# EAGLE design stm_board_f407_1.2.4 (EAGLE 9.6.2)
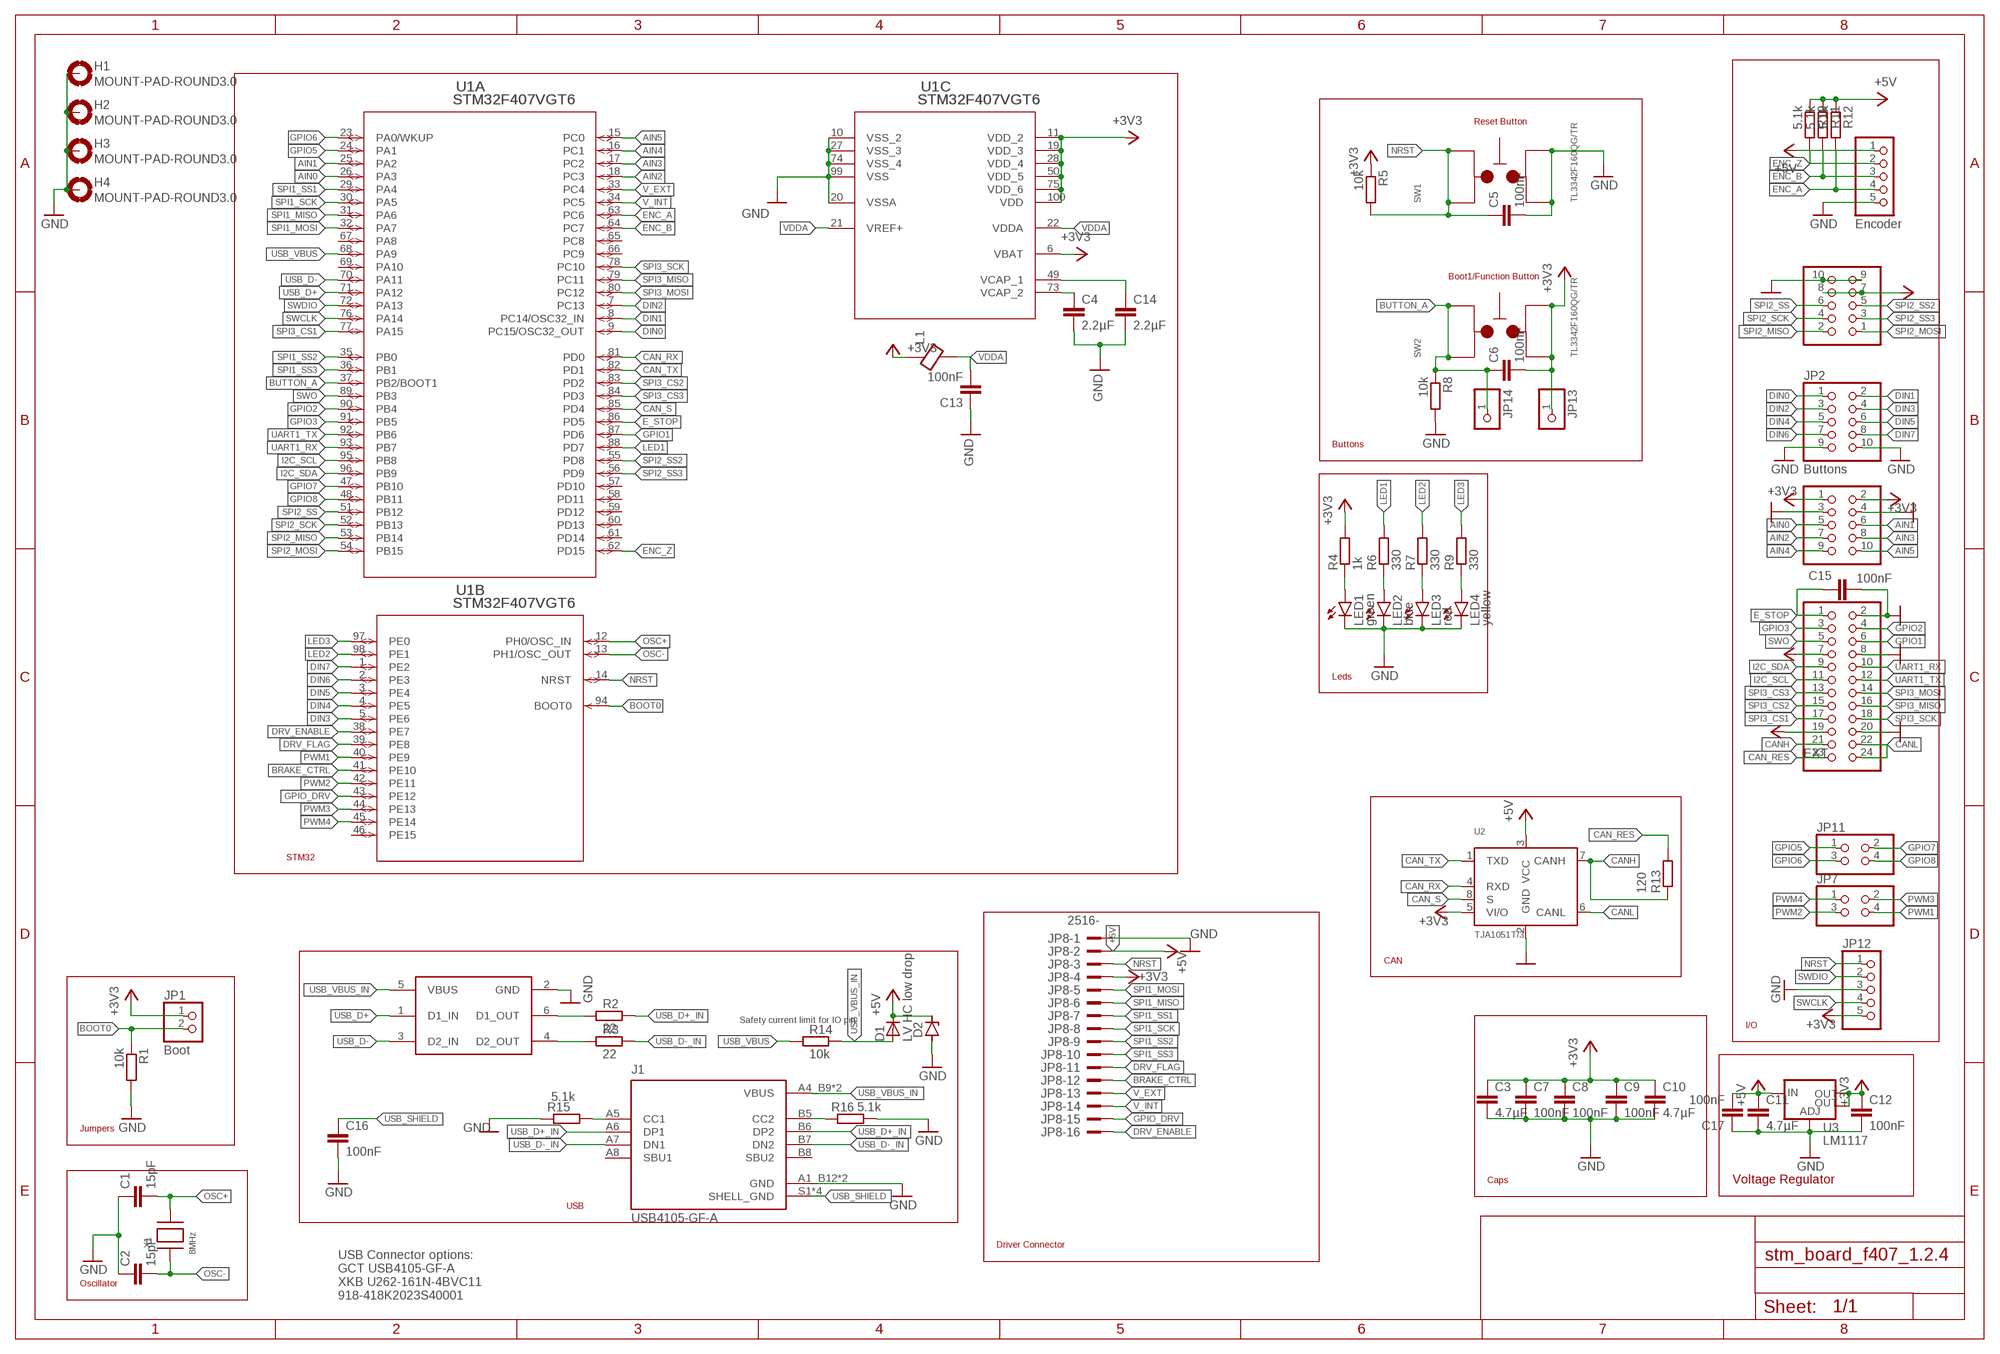
[diagram p0: schematic, sheet 1]

## Parts
C1  15pF  C-EUC0603  [C0603]
C2  15pF  C-EUC0603  [C0603]
C3  4.7µF  C-EUC0805  [C0805]
C4  2.2µF  C-EUC0603  [C0603]
C5  100nF  C-EUC0603  [C0603]
C6  100nF  C-EUC0603  [C0603]
C7  100nF  C-EUC0603  [C0603]
C8  100nF  C-EUC0603  [C0603]
C9  100nF  C-EUC0603  [C0603]
C10  4.7µF  C-EUC0805  [C0805]
C11  4.7µF  C-EUC0805  [C0805]
C12  100nF  C-EUC0603  [C0603]
C13  100nF  C-EUC0603  [C0603]
C14  2.2µF  C-EUC0603  [C0603]
C15  100nF  C-EUC0603  [C0603]
C16  100nF  C-EUC0603  [C0603]
C17  100nF  C-EUC0603  [C0603]
D1  LV HC low drop  DIODESMA  [SMADIODE]
D2  ZENER-DIODESOD80C  [SOD80C]
H1  MOUNT-PAD-ROUND3.0  [3,0-PAD]
H2  MOUNT-PAD-ROUND3.0  [3,0-PAD]
H3  MOUNT-PAD-ROUND3.0  [3,0-PAD]
H4  MOUNT-PAD-ROUND3.0  [3,0-PAD]
J1  USB4105-GF-A  [GCT_USB4105-GF-A]
JP1  Boot  PINHD-1X2  [1X02]
JP2  Buttons  PINHD-2X5  [2X05]
JP3  Analog  PINHD-2X5  [2X05]
JP4  EXT  PINHD-2X12  [2X12]
JP5  Encoder  PINHD-1X5  [1X05]
JP6  SPI  PINHD-2X5  [2X05]
JP7  PINHD-2X2  [2X02]
JP8  2516-  [PAK100/2500-16]
JP11  PINHD-2X2  [2X02]
JP12  PINHD-1X5  [1X05]
JP13  PINHD-1X1  [1X01]
JP14  PINHD-1X1  [1X01]
L1  GZ2012D601TF  BLM21PG331SN1D  [BLM21PG331SN1D]
LED1  green  LEDSML0805  [SML0805]
LED2  blue  LEDSML0805  [SML0805]
LED3  red  LEDSML0805  [SML0805]
LED4  yellow  LEDSML0805  [SML0805]
R1  10k  R-EU_R0603  [R0603]
R2  22  R-EU_R0603  [R0603]
R3  22  R-EU_R0603  [R0603]
R4  1k  R-EU_R0603  [R0603]
R5  10k  R-EU_R0603  [R0603]
R6  330  R-EU_R0603  [R0603]
R7  330  R-EU_R0603  [R0603]
R8  10k  R-EU_R0603  [R0603]
R9  330  R-EU_R0603  [R0603]
R10  5.1k  R-EU_R0603  [R0603]
R11  5.1k  R-EU_R0603  [R0603]
R12  5.1k  R-EU_R0603  [R0603]
R13  120  R-EU_R0603  [R0603]
R14  10k  R-EU_R0603  [R0603]
R15  5.1k  R-EU_R0603  [R0603]
R16  5.1k  R-EU_R0603  [R0603]
SW1  TL3342F160QG/TR  [TL3342F160QG/TR]
SW2  TL3342F160QG/TR  [TL3342F160QG/TR]
U1  STM32F407VGT6  [LQFP100-14X14MM]
U2  TJA1051T/3  [SOT96-1]
U3  LM1117  V_REG_LM1117SOT223  [SOT223]
U4  USBLC6-2SC6  [TSOT-23-6]
X1  8MHz  XTALNX5032  [NX5032]

## Nets
+3V3: C3.1 C6.2 C7.1 C8.1 C9.1 C10.1 C12.1 JP1.1 JP3.1 JP3.2 JP4.7 JP6.7 JP6.8 JP8.4 JP12.5 JP13.1 L1.1 R4.2 R5.1 SW2.1 SW2.2 U1.6(C:VBAT) U1.11(C:VDD_2) U1.19(C:VDD_3) U1.28(C:VDD_4) U1.50(C:VDD_5) U1.75(C:VDD_6) U1.100(C:VDD) U2.5(VI/O) U3.2(OUT) U3.4(OUT)
+5V: C11.1 C17.2 D1.C D2.C JP4.19 JP5.1 JP8.2 R10.1 R11.1 R12.1 U2.3(VCC) U3.3(IN)
AIN0: JP3.5 U1.26(A:PA3)
AIN1: JP3.6 U1.25(A:PA2)
AIN2: JP3.7 U1.18(A:PC3)
AIN3: JP3.8 U1.17(A:PC2)
AIN4: JP3.9 U1.16(A:PC1)
AIN5: JP3.10 U1.15(A:PC0)
BOOT0: JP1.2 R1.1 U1.94(B:BOOT0)
BRAKE_CTRL: JP8.12 U1.41(B:PE10)
BUTTON_A: C6.1 JP14.1 R8.1 SW2.3 SW2.4 U1.37(A:PB2/BOOT1)
CAN_RES: JP4.23 R13.2
CAN_RX: U1.81(A:PD0) U2.4(RXD)
CAN_S: U1.85(A:PD4) U2.8(S)
CAN_TX: U1.82(A:PD1) U2.1(TXD)
CANH: JP4.21 R13.1 U2.7(CANH)
CANL: JP4.22 JP4.24 U2.6(CANL)
DIN0: JP2.1 U1.9(A:PC15/OSC32_OUT)
DIN1: JP2.2 U1.8(A:PC14/OSC32_IN)
DIN2: JP2.3 U1.7(A:PC13)
DIN3: JP2.4 U1.5(B:PE6)
DIN4: JP2.5 U1.4(B:PE5)
DIN5: JP2.6 U1.3(B:PE4)
DIN6: JP2.7 U1.2(B:PE3)
DIN7: JP2.8 U1.1(B:PE2)
DRV_ENABLE: JP8.16 U1.38(B:PE7)
DRV_FLAG: JP8.11 U1.39(B:PE8)
E_STOP: C15.1 JP4.1 U1.86(A:PD5)
ENC_A: JP5.4 R12.2 U1.63(A:PC6)
ENC_B: JP5.3 R11.2 U1.64(A:PC7)
ENC_Z: JP5.2 R10.2 U1.62(A:PD15)
GND: C1.1 C2.1 C3.2 C4.2 C5.2 C7.2 C8.2 C9.2 C10.2 C11.2 C12.2 C13.1 C14.2 C15.2 C16.2 C17.1 D2.A H1.B3,0(MOUNT) H2.B3,0(MOUNT) H3.B3,0(MOUNT) H4.B3,0(MOUNT) J1.A1_B12(GND) J1.B1_A12(GND) JP2.9 JP2.10 JP3.3 JP3.4 JP4.2 JP4.8 JP4.20 JP5.5 JP6.9 JP6.10 JP8.1 JP12.3 LED1.C LED2.C LED3.C LED4.C R1.2 R8.2 R15.1 R16.2 SW1.1 SW1.2 U1.10(C:VSS_2) U1.20(C:VSSA) U1.27(C:VSS_3) U1.74(C:VSS_4) U1.99(C:VSS) U2.2(GND) U3.1(ADJ) U4.2(GND)
GPIO1: JP4.6 U1.87(A:PD6)
GPIO2: JP4.4 U1.90(A:PB4)
GPIO3: JP4.3 U1.91(A:PB5)
GPIO5: JP11.1 U1.24(A:PA1)
GPIO6: JP11.3 U1.23(A:PA0/WKUP)
GPIO7: JP11.2 U1.47(A:PB10)
GPIO8: JP11.4 U1.48(A:PB11)
GPIO_DRV: JP8.15 U1.43(B:PE12)
I2C_SCL: JP4.11 U1.95(A:PB8)
I2C_SDA: JP4.9 U1.96(A:PB9)
LED1: R6.2 U1.88(A:PD7)
LED2: R7.2 U1.98(B:PE1)
LED3: R9.2 U1.97(B:PE0)
N$1: R2.1 U4.6(D1_OUT)
N$2: LED4.A R9.1
N$4: C14.1 U1.49(C:VCAP_1)
N$5: J1.B5(CC2) R16.1
N$6: J1.A5(CC1) R15.2
N$7: C4.1 U1.73(C:VCAP_2)
N$8: R3.1 U4.4(D2_OUT)
N$11: LED1.A R4.1
N$12: LED2.A R6.1
N$13: LED3.A R7.1
NRST: C5.1 JP8.3 JP12.1 R5.2 SW1.3 SW1.4 U1.14(B:NRST)
OSC+: C1.2 U1.12(B:PH0/OSC_IN) X1.P$2
OSC-: C2.2 U1.13(B:PH1/OSC_OUT) X1.P$1
PWM1: JP7.4 U1.40(B:PE9)
PWM2: JP7.3 U1.42(B:PE11)
PWM3: JP7.2 U1.44(B:PE13)
PWM4: JP7.1 U1.45(B:PE14)
SPI1_MISO: JP8.6 U1.31(A:PA6)
SPI1_MOSI: JP8.5 U1.32(A:PA7)
SPI1_SCK: JP8.8 U1.30(A:PA5)
SPI1_SS1: JP8.7 U1.29(A:PA4)
SPI1_SS2: JP8.9 U1.35(A:PB0)
SPI1_SS3: JP8.10 U1.36(A:PB1)
SPI2_MISO: JP6.2 U1.53(A:PB14)
SPI2_MOSI: JP6.1 U1.54(A:PB15)
SPI2_SCK: JP6.4 U1.52(A:PB13)
SPI2_SS: JP6.6 U1.51(A:PB12)
SPI2_SS2: JP6.5 U1.55(A:PD8)
SPI2_SS3: JP6.3 U1.56(A:PD9)
SPI3_CS1: JP4.17 U1.77(A:PA15)
SPI3_CS2: JP4.15 U1.83(A:PD2)
SPI3_CS3: JP4.13 U1.84(A:PD3)
SPI3_MISO: JP4.16 U1.79(A:PC11)
SPI3_MOSI: JP4.14 U1.80(A:PC12)
SPI3_SCK: JP4.18 U1.78(A:PC10)
SWCLK: JP12.4 U1.76(A:PA14)
SWDIO: JP12.2 U1.72(A:PA13)
SWO: JP4.5 U1.89(A:PB3)
UART1_RX: JP4.10 U1.93(A:PB7)
UART1_TX: JP4.12 U1.92(A:PB6)
USB_D+: U1.71(A:PA12) U4.1(D1_IN)
USB_D+_IN: J1.A6(DP1) J1.B6(DP2) R2.2
USB_D-: U1.70(A:PA11) U4.3(D2_IN)
USB_D-_IN: J1.A7(DN1) J1.B7(DN2) R3.2
USB_SHIELD: C16.1 J1.S1(SHELL_GND) J1.S2(SHELL_GND) J1.S3(SHELL_GND) J1.S4(SHELL_GND)
USB_VBUS: R14.1 U1.68(A:PA9)
USB_VBUS_IN: D1.A J1.A4_B9(VBUS) J1.B4_A9(VBUS) R14.2 U4.5(VBUS)
V_EXT: JP8.13 U1.33(A:PC4)
V_INT: JP8.14 U1.34(A:PC5)
VDDA: C13.2 L1.2 U1.21(C:VREF+) U1.22(C:VDDA)
Unconnected: J1.A8(SBU1) J1.B8(SBU2) U1.46(B:PE15) U1.57(A:PD10) U1.58(A:PD11) U1.59(A:PD12) U1.60(A:PD13) U1.61(A:PD14) U1.65(A:PC8) U1.66(A:PC9) U1.67(A:PA8) U1.69(A:PA10)

## Notes on the sheet
- Reset Button
- Boot1/Function Button
- Buttons
- Leds
- STM32
- CAN
- Safety current limit for IO pin
- I/O
- Jumpers
- Caps | Voltage Regulator
- USB
- Driver Connector
- Oscillator
- USB Connector options:
  GCT USB4105-GF-A 
  XKB U262-161N-4BVC11
  918-418K2023S40001

## Library data of the parts
C1-C17 = resistor:C-EU: CAPACITOR, European symbol
D1 = adafruit:DIODE: Diode SMADIODE - SMA Surface Mount Package 20V 1A Schottky Diode Digikey: 641-1014-6-ND DO-1N4148 - Through Hole Small Current Diode SOD-123 20V 1 A (.5mV Vf) Schottky Diode - Digikey: MBRX120TPMSCT-ND SOD-323 10V 570mA (.38mV Vf, 3ns) Schottky Diode - Digikey: ZLLS410CT-ND SOD-523 30V 30mA Schottky Diode (RB751S-40TE61) - Digikey: RB751S-40TE61CT-ND SOT23-R/W - SOT23 Package (R = Solder Paste/Reflow Ovens, W = Hand-Soldering) BAT54Film 40V 300mA - Digikey: 497-7162-1-ND
D2 = diode:ZENER-DIODE: Z-Diode
H1-H4 = holes:MOUNT-PAD-ROUND: MOUNTING PAD, round
J1 = USB4105-GF-A:USB4105-GF-A: USB-C (USB TYPE-C) USB 2.0 Receptacle Connector 24 (16+8 Dummy) Position Surface Mount, Right Angle; Through Hole Check availability <https://pricing.snapeda.com/parts/USB4105-GF-A/GCT/view-part?ref=eda>; AVAILABILITY: In Stock; DESCRIPTION: USB-C (USB TYPE-C) USB 2.0 Receptacle Connector 24 (16+8 Dummy) Position Surface Mount, Right Angle; Through Hole; MF: GCT; MP: USB4105-GF-A; PACKAGE: None; PRICE: None; PURCHASE-URL: https://pricing.snapeda.com/search/part/USB4105-GF-A/?ref=eda
JP1 = pinhead:PINHD-1X2: PIN HEADER
JP2 JP3 JP6 = pinhead:PINHD-2X5: PIN HEADER
JP4 = pinhead:PINHD-2X12: PIN HEADER
JP5 JP12 = pinhead:PINHD-1X5: PIN HEADER
JP7 JP11 = pinhead:PINHD-2X2: PIN HEADER
JP8 = con-3m:2516-: 3M (TM) Pak 100 4-Wall Header Source: 3M; OC_FARNELL: unknown; OC_NEWARK: unknown
JP13 JP14 = pinhead:PINHD-1X1: PIN HEADER
L1 = Thermistor_Inductors:BLM21PG331SN1D: FERRITE BEAD 330 OHM 0805 1LN Manufacturer's datasheet <https://www.murata.com/en-us/products/en-us/products/productdata/8796738977822/ENFA0005.pdf>; CREATED_BY: PCBLayout.com; DIGIKEY_PART_NUMBER: 490-5988-2-ND; MANUFACTURER: Murata Electronics North America; MPN: BLM21PG331SN1D; PACKAGE: 0805
LED1-LED4 = led:LED: LED OSRAM: - CHIPLED LG R971, LG N971, LY N971, LG Q971, LY Q971, LO R971, LY R971 LH N974, LH R974 LS Q976, LO Q976, LY Q976 LO Q996 - Hyper CHIPLED LW Q18S LB Q993, LB Q99A, LB R99A - SideLED LS A670, LO A670, LY A670, LG A670, LP A670 LB A673, LV A673, LT A673, LW A673 LH A674 LY A675 LS A676, LA A676, LO A676, LY A676, LW A676 LS A679, LY A679, LG A679 - Hyper Micro SIDELED® LS Y876, LA Y876, LO Y876, LY Y876 LT Y87S - SmartLED LW L88C, LW L88S LB L89C, LB L89S, LG L890 LS L89K, LO L89K, LY L89K LS L896, LA L896, LO L896, LY L896 - TOPLED LS T670, LO T670, LY T670, LG T670, LP T670 LSG T670, LSP T670, LSY T670, LOP T670, LYG T670 LG T671, LOG T671, LSG T671 LB T673, LV T673, LT T673, LW T673 LH T674 LS T676, LA T676, LO T676, LY T676, LB T676, LH T676, LSB T676, LW T676 LB T67C, LV T67C, LT T67C, LS T67K, LO T67K, LY T67K, LW E67C LS E67B, LA E67B, LO E67B, LY E67B, LB E67C, LV E67C, LT E67C LW T67C LS T679, LY T679, LG T679 LS T770, LO T770, LY T770, LG T770, LP T770 LB T773, LV T773, LT T773, LW T773 LH T774 LS E675, LA E675, LY E675, LS T675 LS T776, LA T776, LO T776, LY T776, LB T776 LHGB T686 LT T68C, LB T68C - Hyper Mini TOPLED® LB M676 - Mini TOPLED Santana® LG M470 LS M47K, LO M47K, LY M47K Source: http://www.osram.convergy.de LUXEON: - LUMILED® LXK2-PW12-R00, LXK2-PW12-S00, LXK2-PW14-U00, LXK2-PW14-V00 LXK2-PM12-R00, LXK2-PM12-S00, LXK2-PM14-U00 LXK2-PE12-Q00, LXK2-PE12-R00, LXK2-PE12-S00, LXK2-PE14-T00, LXK2-PE14-U00 LXK2-PB12-K00, LXK2-PB12-L00, LXK2-PB12-M00, LXK2-PB14-N00, LXK2-PB14-P00, LXK2-PB14-Q00 LXK2-PR12-L00, LXK2-PR12-M00, LXK2-PR14-Q00, LXK2-PR14-R00 LXK2-PD12-Q00, LXK2-PD12-R00, LXK2-PD12-S00 LXK2-PH12-R00, LXK2-PH12-S00 LXK2-PL12-P00, LXK2-PL12-Q00, LXK2-PL12-R00 Source: www.luxeon.com KINGBRIGHT: KA-3528ASYC Source: www.kingbright.com
R1-R16 = resistor:R-EU_: RESISTOR, European symbol
SW1 SW2 = Switch:TL3342F160QG/TR: SWITCH TACTILE SPST-NO 0.05A 12V Manufacturer's datasheet <http://spec_sheets.e-switch.com/specs/P010632.pdf>; CREATED_BY: PCBLayout.com; DIGI_KEY_PART_NUMBER: EG2531CT-ND; MANUFACTURER: E-Switch; MPN: TL3342F160QG/TR; PACKAGE: SPST_NO
U1 = STM32:STM32F407VGT6; BUILT_BY: EMA_UL_Team; COPYRIGHT: Copyright (C) 2018 Accelerated Designs. All rights reserved; MANUFACTURER_PART_NUMBER: STM32F407VGT6; SOURCELIBRARY: Updates_to_database_2020-10-19; VENDOR: STMicroelectronics
U2 = TJA1051T_3:TJA1051T/3: High-speed CAN transceiver The TJA1051 is a high-speed CAN transceiver that provides an interface between a Controller Area Network (CAN) protocol controller and the physical two-wire CAN bus. The transceiver is designed for high-speed (up to 1 Mbit/s) CAN applications in the automotive industry, providing differential transmit and receive capability to (a microcontroller with) a CAN protocol controller. The TJA1051 belongs to the third generation of high-speed CAN transceivers from NXP Semiconductors, offering significant improvements over first- and second-generation devices such as the TJA1050. It offers improved ElectroMagnetic Compatibility (EMC) and ElectroStatic Discharge (ESD) performance, and also features: Ideal passive behavior to the CAN bus when the supply voltage is off TJA1051T/3 and TJA1051TK/3 can be interfaced directly to microcontrollers with supply voltages from 3 V to 5 V These features make the TJA1051 an excellent choice for all types of HS-CAN networks, in nodes that do not require a standby mode with wake-up capability via the bus. AAL Eindhoven MK Check prices <https://pricing.snapeda.com/search/part/TJA1051T/3/?ref=eda>; AVAILABILITY: Bad; DESCRIPTION: 1/1 Transceiver Half CANbus 8-SO; MF: NXP Semiconductors; MP: TJA1051T/3; PACKAGE: SOIC-8 NXP Semiconductors; PRICE: None
U3 = SparkFun-IC-Power:V_REG_LM1117: Voltage Regulator LM1117 Standard adjustable voltage regulator but in SMD form. Spark Fun Electronics SKU : COM-00595; PROD_ID: VREG-08170
U4 = con_ampusb_10118193-0001LF:USBLC6-2SC6
X1 = adafruit:XTAL: Low cost SMT crystals, no capacitors included http://www.ladyada.net/library/eagle

## Board
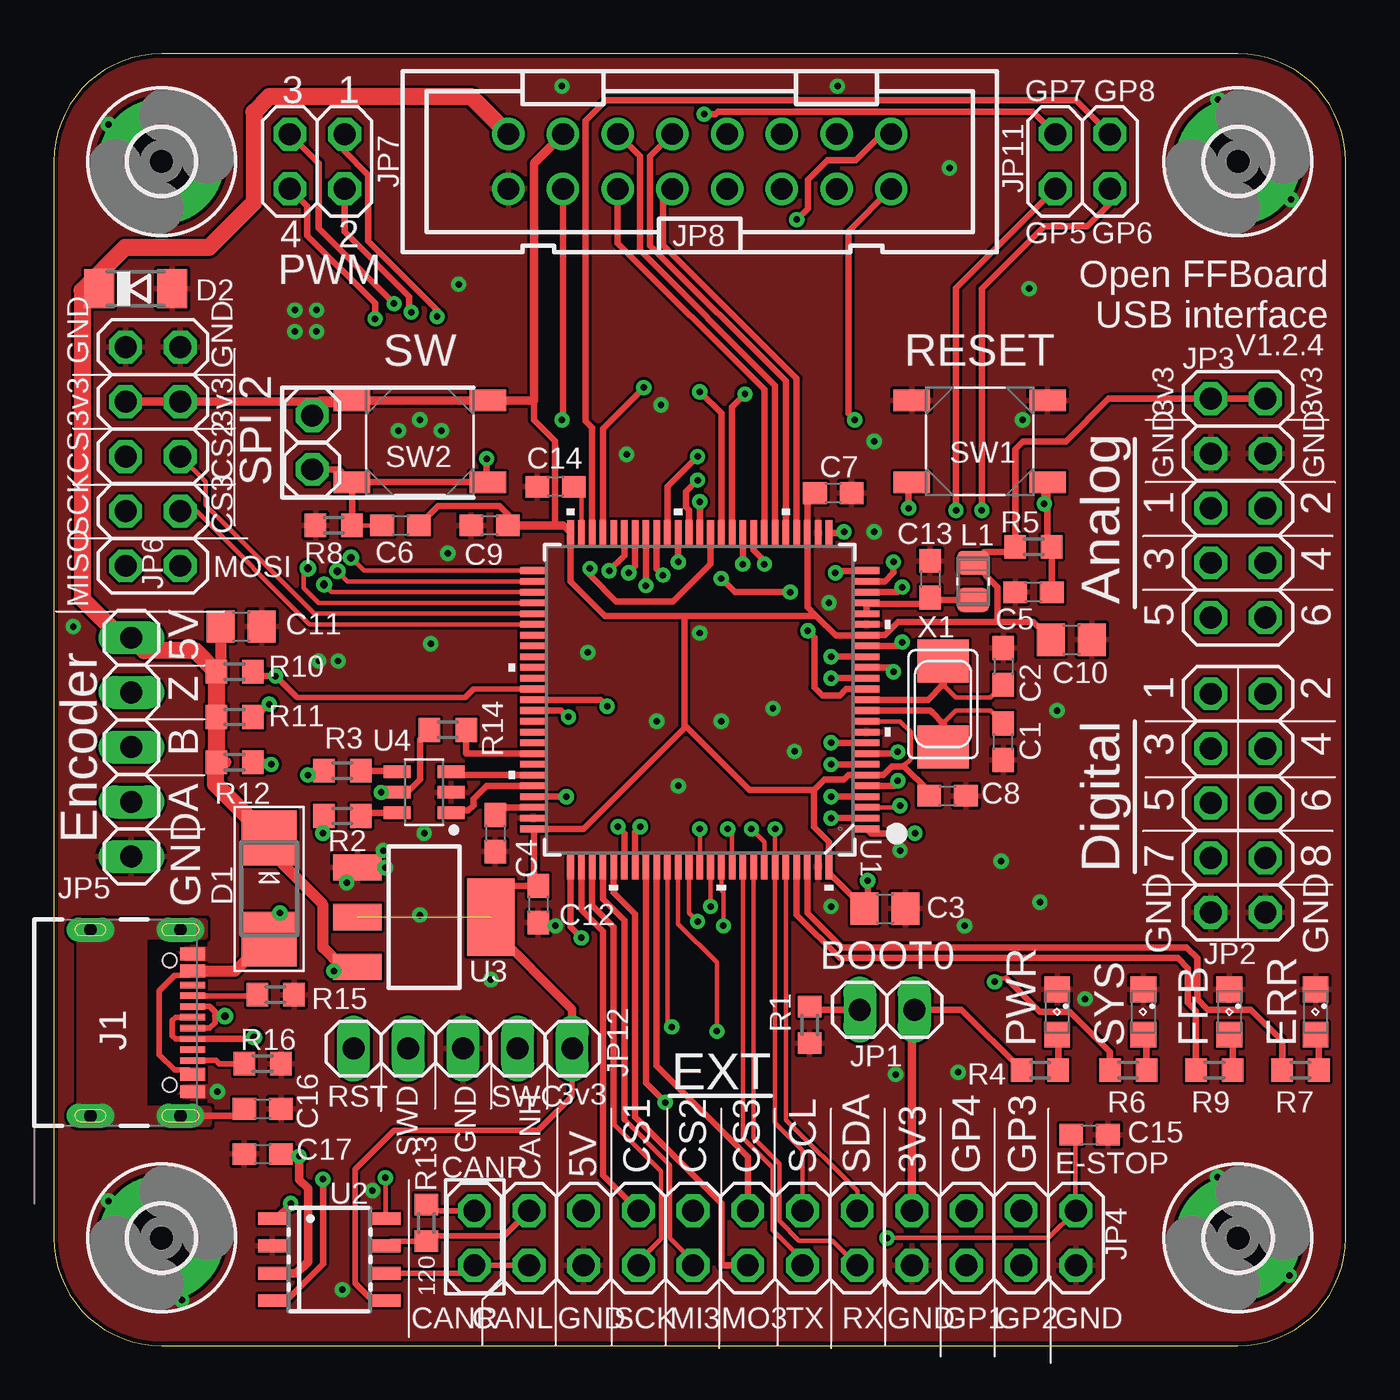
[diagram p1: board, top side]
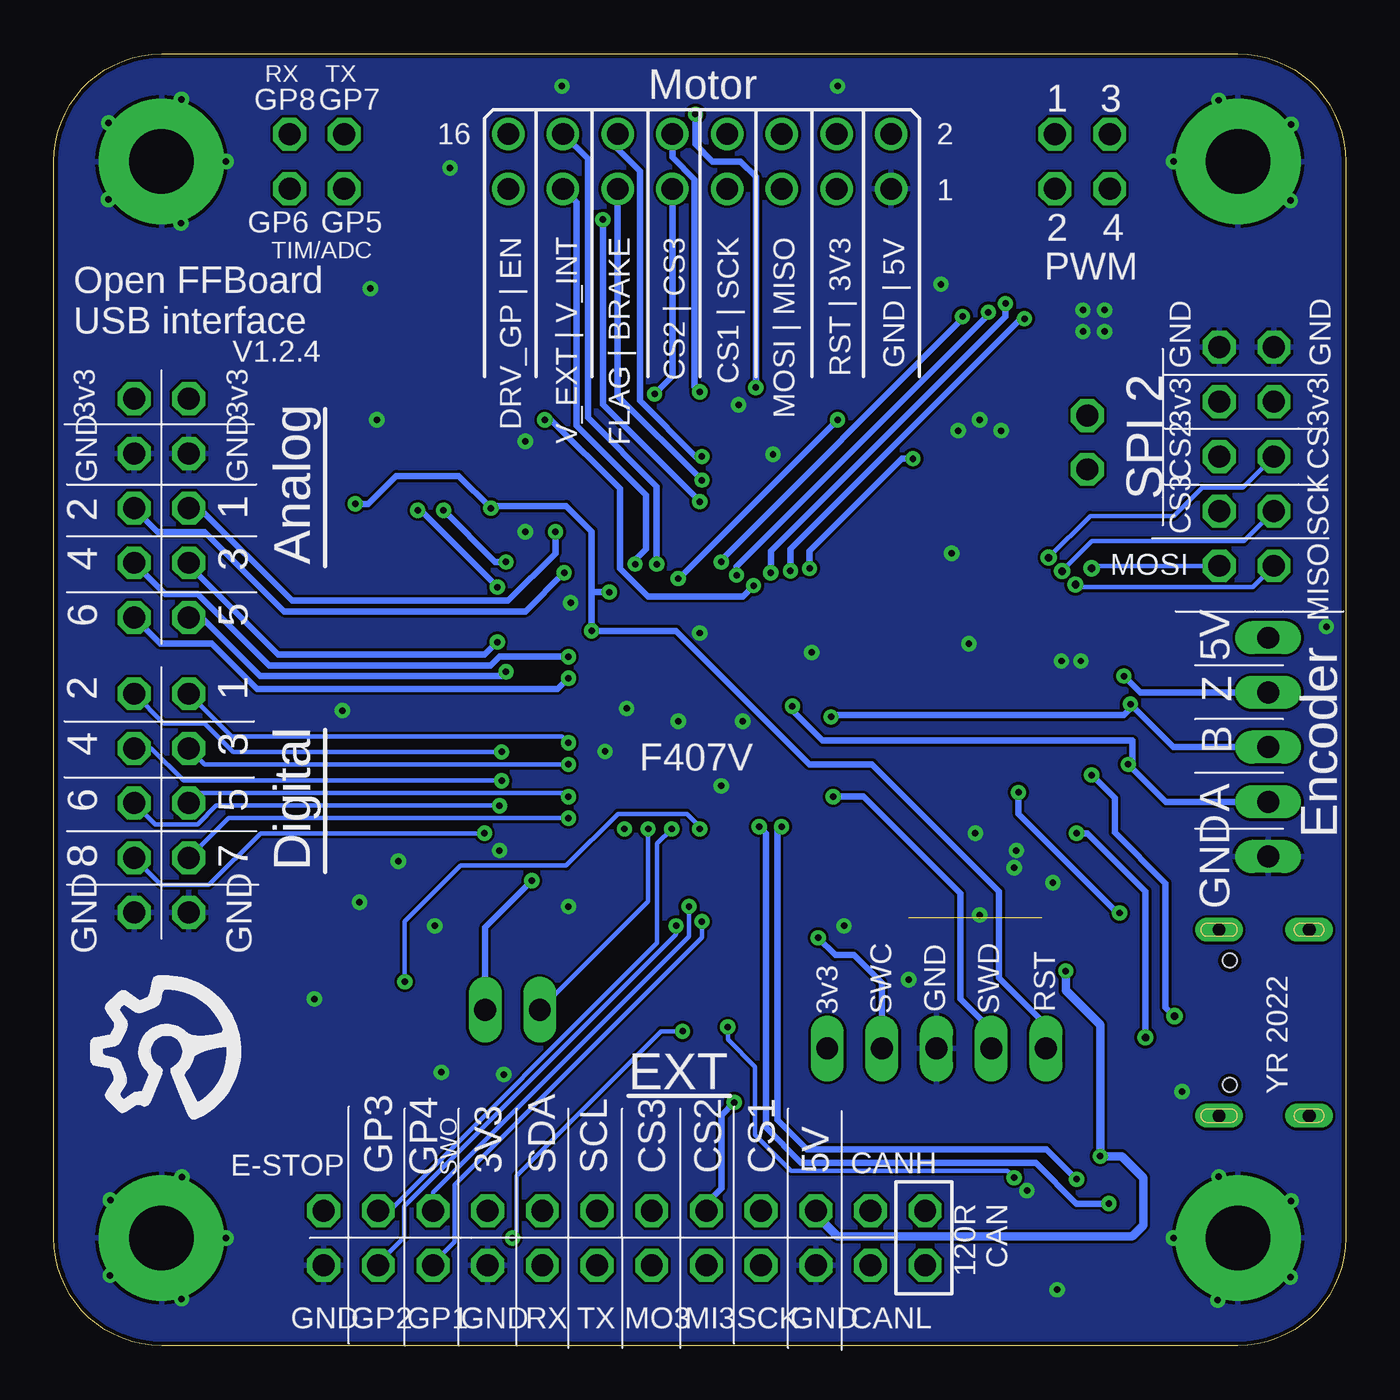
[diagram p2: board, bottom side, seen from below]

Size 60 x 60 mm. Coordinates in mm from the lower left corner, seen from the top.
Outline: 5,0 55,0 arc90 60,5 60,55 arc90 55,60 5,60 arc90 0,55 0,5 arc90 5,0
Copper layers (1*16): Top 0.035mm / dielectric 1.5mm / Bottom 0.035mm
Design rules "jlcpcb *": minimum track width 5mil, minimum drill 0.3mm, track to track 5mil, track to pad 5mil, pad to pad 5mil, via to via 5mil, smd to smd 5mil, copper to edge 0.2mm, drill to drill 8mil, minimum pad ring 10mil, minimum via ring 8mil, stop-mask expansion 2mil, vias tented up to drill 0.4mm, thermal gap 6mil

### Footprints (pad centres in the part's own frame; a part is rotated, then mirrored left to right if it is on the bottom)
C0603 = smd 1.1 x 1: 1 -0.85,0; 2 0.85,0
C0805 = smd 1.3 x 1.5: 1 -0.95,0; 2 0.95,0
SMADIODE = smd 2.54 x 2.54: A 2.349,0; C -2.349,0
SOD80C = smd 1.4 x 1.8: A 1.7,0; C -1.7,0
3,0-PAD = drill 3 pad 5.842: B3,0 0,0
GCT_USB4105-GF-A = smd 0.6 x 1.15: A1_B12 -3.2,4.755; A4_B9 -2.4,4.755; B1_A12 3.2,4.755; B4_A9 2.4,4.755 | smd 0.3 x 1.15: A5 -1.25,4.755; A6 -0.25,4.755; A7 0.25,4.755; A8 1.25,4.755; B5 1.75,4.755; B6 0.75,4.755; B7 -0.75,4.755; B8 -1.75,4.755 | drill 0.6 pad 1.05 long: S1 -4.32,4.18; S4 4.32,4.18 | drill 0.6 pad 1 long: S2 -4.32,0; S3 4.32,0 | hole 0.65: 2.89,3.68; -2.89,3.68
1X02 = drill 1.016 long: 1 -1.27,0; 2 1.27,0
2X05 = drill 1.016 octagon: 1 -5.08,-1.27; 2 -5.08,1.27; 3 -2.54,-1.27; 4 -2.54,1.27; 5 0,-1.27; 6 0,1.27; 7 2.54,-1.27; 8 2.54,1.27; 9 5.08,-1.27; 10 5.08,1.27
2X12 = drill 1.016 octagon: 1 -13.97,-1.27; 2 -13.97,1.27; 3 -11.43,-1.27; 4 -11.43,1.27; 5 -8.89,-1.27; 6 -8.89,1.27; 7 -6.35,-1.27; 8 -6.35,1.27; 9 -3.81,-1.27; 10 -3.81,1.27; 11 -1.27,-1.27; 12 -1.27,1.27; 13 1.27,-1.27; 14 1.27,1.27; 15 3.81,-1.27; 16 3.81,1.27; 17 6.35,-1.27; 18 6.35,1.27; 19 8.89,-1.27; 20 8.89,1.27; 21 11.43,-1.27; 22 11.43,1.27; 23 13.97,-1.27; 24 13.97,1.27
1X05 = drill 1.016 long: 1 -5.08,0; 2 -2.54,0; 3 0,0; 4 2.54,0; 5 5.08,0
2X02 = drill 1.016 octagon: 1 -1.27,-1.27; 2 -1.27,1.27; 3 1.27,-1.27; 4 1.27,1.27
PAK100/2500-16 = drill 1 pad 1.422: 1 -8.89,-1.27; 2 -8.89,1.27; 3 -6.35,-1.27; 4 -6.35,1.27; 5 -3.81,-1.27; 6 -3.81,1.27; 7 -1.27,-1.27; 8 -1.27,1.27; 9 1.27,-1.27; 10 1.27,1.27; 11 3.81,-1.27; 12 3.81,1.27; 13 6.35,-1.27; 14 6.35,1.27; 15 8.89,-1.27; 16 8.89,1.27
1X01 = drill 1.016 octagon: 1 0,0
BLM21PG331SN1D = smd 1.09 x 1.47: 1 -0.865,0; 2 0.865,0
SML0805 = smd 1.2 x 1.2: A 1.05,0; C -1.05,0
R0603 = smd 1 x 1.1: 1 -0.85,0; 2 0.85,0
TL3342F160QG/TR = smd 1.7 x 1: 1 -3.15,-1.9; 2 3.15,-1.9; 3 -3.15,1.9; 4 3.15,1.9
LQFP100-14X14MM = smd 0.305 x 1.194: 1 -6,-7.75; 2 -5.5,-7.75; 3 -5,-7.75; 4 -4.5,-7.75; 5 -4,-7.75; 6 -3.5,-7.75; 7 -3,-7.75; 8 -2.5,-7.75; 9 -2,-7.75; 10 -1.5,-7.75; 11 -1,-7.75; 12 -0.5,-7.75; 13 0,-7.75; 14 0.5,-7.75; 15 1,-7.75; 16 1.5,-7.75; 17 2,-7.75; 18 2.5,-7.75; 19 3,-7.75; 20 3.5,-7.75; 21 4,-7.75; 22 4.5,-7.75; 23 5,-7.75; 24 5.5,-7.75; 25 6,-7.75; 51 6,7.75; 52 5.5,7.75; 53 5,7.75; 54 4.5,7.75; 55 4,7.75; 56 3.5,7.75; 57 3,7.75; 58 2.5,7.75; 59 2,7.75; 60 1.5,7.75; 61 1,7.75; 62 0.5,7.75; 63 0,7.75; 64 -0.5,7.75; 65 -1,7.75; 66 -1.5,7.75; 67 -2,7.75; 68 -2.5,7.75; 69 -3,7.75; 70 -3.5,7.75; 71 -4,7.75; 72 -4.5,7.75; 73 -5,7.75; 74 -5.5,7.75; 75 -6,7.75 | smd 1.194 x 0.305: 26 7.75,-6; 27 7.75,-5.5; 28 7.75,-5; 29 7.75,-4.5; 30 7.75,-4; 31 7.75,-3.5; 32 7.75,-3; 33 7.75,-2.5; 34 7.75,-2; 35 7.75,-1.5; 36 7.75,-1; 37 7.75,-0.5; 38 7.75,0; 39 7.75,0.5; 40 7.75,1; 41 7.75,1.5; 42 7.75,2; 43 7.75,2.5; 44 7.75,3; 45 7.75,3.5; 46 7.75,4; 47 7.75,4.5; 48 7.75,5; 49 7.75,5.5; 50 7.75,6; 76 -7.75,6; 77 -7.75,5.5; 78 -7.75,5; 79 -7.75,4.5; 80 -7.75,4; 81 -7.75,3.5; 82 -7.75,3; 83 -7.75,2.5; 84 -7.75,2; 85 -7.75,1.5; 86 -7.75,1; 87 -7.75,0.5; 88 -7.75,0; 89 -7.75,-0.5; 90 -7.75,-1; 91 -7.75,-1.5; 92 -7.75,-2; 93 -7.75,-2.5; 94 -7.75,-3; 95 -7.75,-3.5; 96 -7.75,-4; 97 -7.75,-4.5; 98 -7.75,-5; 99 -7.75,-5.5; 100 -7.75,-6
SOT96-1 = smd 0.6 x 1.3: 1 -1.905,-2.65; 2 -0.635,-2.65; 3 0.635,-2.65; 4 1.905,-2.65; 5 1.905,2.65; 6 0.635,2.65; 7 -0.635,2.65; 8 -1.905,2.65
SOT223 = smd 1.219 x 2.235: 1 -2.311,-3.099; 2 0,-3.099; 3 2.311,-3.099 | smd 3.6 x 2.2: 4 0,3.099
TSOT-23-6 = smd 1.25 x 0.589: 1 -1.256,0.95; 2 -1.256,0; 3 -1.256,-0.95; 4 1.256,-0.95; 5 1.256,0; 6 1.256,0.95
NX5032 = smd 2 x 2.4: P$1 2,0; P$2 -2,0

### Placement (x,y rotation side)
C1  44.1,28.05 90 top
C2  44.1,31.55 270 top
C3  38.6,20.3 0 top
C4  20.5,23.8 270 top
C5  45.5,35 180 top
C6  16.1,38.1 0 top
C7  36.2,39.6 0 top
C8  41.51,25.54 0 top
C9  20.24,38.1 180 top
C10  47.26,32.79 0 top
C11  8.7,33.4 0 top
C12  22.5,20.5 270 top
C13  40.7,35.6 270 top
C14  23.3,39.9 180 top
C15  48.1,9.8 0 top
C16  9.7,11 0 top
C17  9.7,8.9 0 top
D1  10,21.23 270 top
D2  3.8,49.1 0 top
H1  55,5 0 top
H2  5,5 0 top
H3  55,55 0 top
H4  5,55 0 top
J1  1.7,15 270 top
JP1  38.7,15.6 180 top
JP2  55,25.2 270 top
JP3  55,38.9 270 top
JP4  33.5,5 180 top
JP5  3.6,27.8 270 top
JP6  4.6,41.3 90 top
JP7  12.23,55 0 top
JP8  30,55 0 top
JP11  47.78,55 0 top
JP12  19,13.8 0 top
JP13  12,43.2 0 top
JP14  12,40.7 0 top
L1  42.7,35.5 270 top
LED1  46.6,15.5 270 top
LED2  50.6,15.5 270 top
LED3  58.6,15.5 270 top
LED4  54.6,15.5 270 top
R1  35.1,14.9 270 top
R2  13.4,24.6 180 top
R3  13.4,26.7 180 top
R4  45.8,12.8 180 top
R5  45.5,37.1 0 top
R6  49.9,12.8 180 top
R7  57.9,12.8 180 top
R8  13,38.1 180 top
R9  53.9,12.8 180 top
R10  8.4,31.3 0 top
R11  8.4,29.2 0 top
R12  8.4,27.1 0 top
R13  17.3,5.7 90 top
R14  18.3,28.6 180 top
R15  10.3,16.3 180 top
R16  9.7,13.1 0 top
SW1  43,42 180 top
SW2  17,42 180 top
U1  30,30 90 top
U2  12.8,4 270 top
U3  17.2,19.9 270 top
U4  17.2,25.7 180 top
X1  41.3,29.8 90 top

### Tracks (layer width: path | path; a pad name or v marks a point on that pad's centre or on a via)
+3V3  (via drill 0.3)  (1 unrouted)
  Top 0.2: C7.1 35,39.25 | 37.73,32.98 U1.19 | U1.11 39.3,29 39.8,28.5 39.8,27.26 39.47,26.93 39.44,26.9 | C8.1 40.66,25.74
  Top 0.25: U2.5 14.8,2.09 14,2.9 14,8.2 15.8,10 22.5,10 24.08,11.58 JP12.5
  Top 0.3: JP3.2 JP3.1 48.98,43.98 47,42 45,42 44.65,41.65 R5.1 44.65,36.86 43.2,36.86 L1.1 | U1.75 22.3,24 22.3,21.55 C12.1 21.35,21.35 20.3,20.3 U3.4 | 23.65,38.1 U1.50 | 35,39.25 U1.28 35,34.3 35.4,33.9 | 35.4,33.9 36.32,32.98 37.73,32.98 | 35.3,25.8 35.8,26.3 36.7,26.3 36.9,26.5 U1.6 38.52,26.5 38.92,26.9 39.44,26.9 | 35.3,25.8 35.3,24.1 36,23.4 U1.100 36,21.95 C3.1 37.8,20.45 v37.8,21.6 | 40.66,25.74 39.47,26.93 | 24,36.72 U1.50 | U1.75 24.6,24 29.3,28.7 | 29.3,28.7 29.35,28.75 32.3,25.8 35.3,25.8 | U1.50 24,35.5 25.6,33.9 29.28,33.9 29.29,33.89 | 42.5,36.56 L1.1 | U1.19 38.6,33 39.2,33.6 43.7,33.6 | 43.7,33.6 43.82,33.72 43.82,35.24 L1.1 | 35.4,33.9 29.3,33.9 29.29,33.89 | 29.3,28.7 29.3,33.88 29.29,33.89 | C10.1 45.5,33.6 43.7,33.6 | R4.2 42.15,15.6 JP1.1 | 23.28,38.1 23.28,42.02 22.3,43 22.3,43.9 | C6.2 17.85,39 20.7,39 21.09,38.61 C9.1 | U1.75 22.3,23.95 | JP13.1 12.64,43.84 13.79,43.84
  Top 0.4: JP8.4 22.3,54.92 22.3,43.9 SW2.1 SW2.2 13.79,43.84 JP6.7 JP6.8 | 22.3,38.1 C9.1 23.28,38.1 23.65,38.1 | JP4.7 39.85,15.47 JP1.1 | U3.4 20.3,19.4 24.08,15.62 JP12.5
  Top 0.5: 12.37,43.84 13.79,43.84
  Bottom 0.3: JP1.1 39.97,19.43 v37.8,21.6
+5V  (via drill 0.3)
  Top 0.3: 11.4,8.9 v11.4,8.8 11.3,8.9 C17.2 | U3.3 14.1,17.2
  Top 0.4: U2.3 11.27,3.37 11.8,3.9 11.8,7.3 11.4,7.7 v11.4,8.8 | v13,17.4 13.19,17.59 U3.3
  Top 0.5: R12.1 8,27.1 7.5,26.6 7.46,26.56 | D1.C 10,22.99 12.5,20.49 12.5,18.49 13.4,17.59 U3.3 | D2.C 2.01,49.01 1.31,49.01 | C11.1 7.75,31.5 R10.1
  Top 0.8: R12.1 R11.1 R10.1 6.57,32.28 4.2,32.28 JP5.1 3.12,32.88 1.31,34.69 1.31,49.01 3.3,51 7.2,51 9.3,53.1 9.3,57.3 10.01,58.01 19.37,58.01 JP8.2 | 7.5,26.6 7.5,26.08 D1.C
  Bottom 0.4: JP4.19 24.61,6.08 23.61,5.08 9.92,5.08 9.4,5.6 9.4,7.8 10.4,8.8 v11.4,8.8 11.4,14.9 13,16.5 v13,17.4
AIN0  (via drill 0.3)
  Top 0.2: 36.65,37.75 v36.7,37.8
  Top 0.3: U1.26 36.65,37.75
  Bottom 0.3: v36.7,37.8 36.7,36.8 38.9,34.6 48.94,34.6 53.24,38.9 JP3.5
AIN1  (via drill 0.3)
  Top 0.2: 37.73,35.98 U1.25
  Top 0.3: 37.73,35.98 36.56,35.98 36.48,35.9 v36.3,35.9
  Bottom 0.3: JP3.6 55.17,37.8 53,37.8 49.3,34.1 38.1,34.1 v36.3,35.9
AIN2  (via drill 0.3)
  Top 0.3: U1.18 39.22,32.5 v39.4,32.68
  Bottom 0.2: 53.73,36.26 JP3.7
  Bottom 0.3: v39.4,32.68 39.42,32.68 39.99,32.11 49.58,32.11 53.73,36.26
AIN3  (via drill 0.3)
  Top 0.3: U1.17 v36.1,32
  Bottom 0.3: JP3.8 54.82,34.91 53.32,34.91 49.99,31.58 39.72,31.58 39.3,32 v36.1,32
AIN4  (via drill 0.3)
  Top 0.3: v39,31.3 38.8,31.5 U1.16
  Bottom 0.2: JP3.9 53.13,33.82
  Bottom 0.3: 53.13,33.82 50.41,31.1 39.2,31.1 v39,31.3
AIN5  (via drill 0.3)
  Top 0.3: U1.15 v36.1,31
  Bottom 0.3: v36.1,31 36.6,30.5 50.55,30.5 52.67,32.62 55.07,32.62 JP3.10
BOOT0  (via drill 0.3)
  Top 0.2: U1.94 33,23.4 v32.4,24
  Top 0.3: JP1.2 35.25,15.6 R1.1
  Bottom 0.2: v32.4,24 32.4,20.63 JP1.2
BRAKE_CTRL  (via drill 0.3)
  Top 0.3: U1.41 28.5,39.9 v29.9,41.3
  Bottom 0.3: v29.9,41.3 30.19,41.3 32.78,43.89 32.78,54.56 33.81,55.59 JP8.12
BUTTON_A  (via drill 0.3)
  Top 0.2: C6.1 R8.1
  Top 0.3: v24.9,36.1 24.9,35.79 26.12,34.57 28.76,34.57 30.5,36.31 U1.37 | v20.1,41.2 20.1,40.15 SW2.3 SW2.4 | SW2.4 R8.1 | JP14.1 13.25,40.7 SW2.4
  Bottom 0.3: v24.9,36.1 24.9,36.9 20.6,41.2 v20.1,41.2
CAN_RES
  Top 0.254: JP4.23 17.58,6.27 R13.2
CAN_RX  (via drill 0.3)
  Top 0.3: v26.2,24.1 26.5,23.8 U1.81 | U2.4 10.8,2.09 12.5,3.8 v12.5,7.73
  Bottom 0.3: v26.2,24.1 26.4,23.9 26.4,10.5 25.03,9.13 13.9,9.13 v12.5,7.73
CAN_S  (via drill 0.3)
  Top 0.2: U2.8 15.4,5.95 v15.4,7.8 | U1.85 28.5,15 v28.7,14.8
  Bottom 0.2: v15.4,7.8 15.72,8.12 25.76,8.12 27.43,9.8 27.43,12.96 28.7,14.22 v28.7,14.8
CAN_TX  (via drill 0.3)
  Top 0.3: v11,6.6 10.3,5.91 U2.1 | v27.23,24.1 27,23.87 U1.82
  Bottom 0.3: v11,6.6 12.5,6.6 14.4,8.5 25.29,8.5 26.93,10.14 26.93,23.8 v27.23,24.1
CANH
  Top 0.254: U2.7 15.66,4.85 R13.1 17.55,5.1 20.9,5.1 JP4.21
CANL
  Top 0.254: U2.6 19.53,3.37 JP4.24 JP4.22
DIN0  (via drill 0.3)
  Top 0.3: v36.1,28 U1.9
  Bottom 0.2: JP2.1 51.75,28.3 36.4,28.3 v36.1,28
DIN1  (via drill 0.3)
  Top 0.2: 39.12,27.5 v39.2,27.58
  Top 0.3: U1.8 39.12,27.5
  Bottom 0.2: v39.2,27.58 51.68,27.58 53,28.9 54.89,28.9 JP2.2
DIN2  (via drill 0.3)
  Top 0.3: v36.1,27 U1.7
  Bottom 0.2: JP2.3 52.99,27 v36.1,27
DIN3  (via drill 0.3)
  Top 0.2: 39.2,26.18 v39.2,26.24
  Top 0.3: 39.2,26.18 39.02,26 U1.5
  Bottom 0.2: v39.2,26.24 53.97,26.24 55.47,27.74 JP2.4
DIN4  (via drill 0.3)
  Top 0.3: v36.1,25.5 U1.4
  Bottom 0.2: v36.1,25.5 36.26,25.66 53.27,25.66 JP2.5
DIN5  (via drill 0.3)
  Top 0.2: U1.3 39.22,25 v39.3,25.08
  Bottom 0.2: v39.3,25.08 52.45,25.08 53.32,24.21 55.28,24.21 JP2.6
DIN6  (via drill 0.3)
  Top 0.3: v36.1,24.5 U1.2
  Bottom 0.2: JP2.7 51.89,24.5 v36.1,24.5
DIN7  (via drill 0.3)
  Top 0.3: v40,23.8 37.95,23.8 U1.1
  Bottom 0.2: v40,23.8 50.4,23.8 52.8,21.4 55.01,21.4 JP2.8
DRV_ENABLE  (via drill 0.3)
  Top 0.3: U1.38 v30,39.2 | JP8.16 38.47,56.27 37.26,55.06 35.92,55.06 35.02,54.16 35.02,52.82 v34.5,52.3
  Bottom 0.3: v30,39.2 34.5,43.7 v34.5,52.3
DRV_FLAG  (via drill 0.3)
  Top 0.3: U1.39 29.5,38.81 29.37,38.94 29.37,39.67 v29.9,40.2
  Bottom 0.3: v29.9,40.2 33.81,44.11 JP8.11
E_STOP  (via drill 0.3)
  Top 0.2: U1.86 29,19.6 30.8,17.8 v30.8,14.6 | v38.7,5 46.2,5 JP4.1 47.45,6.27 47.45,9.6 C15.1
  Bottom 0.2: v30.8,14.6 31.8,14.6 38.5,7.9 38.5,5.2 v38.7,5
ENC_A  (via drill 0.3)
  Top 0.3: U1.63 25.4,30 v25.7,29.7 | v10.1,27 10,27.1 R12.2
  Bottom 0.3: JP5.4 8.36,25.26 v10.1,27 9.9,27.2 9.9,28.1 24.3,28.1 25.7,29.5 v25.7,29.7
ENC_B  (via drill 0.3)
  Top 0.3: U1.64 23.55,29.5 23.85,29.2 v23.9,29.2 | v10,29.8 9.4,29.2 R11.2
  Bottom 0.3: v23.9,29.2 23.8,29.3 10.3,29.3 9.8,29.8 v10,29.8 8,27.8 JP5.3
ENC_Z  (via drill 0.3)
  Top 0.254: U1.62 19.5,30.5 19.1,30.1 11.3,30.1 v10.3,31.1
  Top 0.3: 9.45,31.5 R10.2 9.45,31.1 v10.3,31.1
  Bottom 0.3: JP5.2 9.54,30.34 v10.3,31.1
GND  (via drill 0.3)
  other vias: 45,43 17,43 20.3,17 15.4,22.2 18.8,49.3 23.6,58.5 36.4,58.5 36.1,20.4 15.3,23 28.2,43.7 26.6,41.4 52,5 54.05,7.84 57.38,6.76 57.39,3.27 54.06,2.18 52,55 54.08,57.88 57.45,56.79 57.46,53.24 54.09,52.14 8,55 2.57,53.18 2.54,56.72 5.89,57.85 8,5 5.94,2.12 2.57,3.18 2.54,6.72 5.89,7.85 39.3,23 36,34.5 28,29 31,29 29,26 47.9,16.1 24.8,32.2 33.4,29.6 12.2,47.1 13.2,31.8 13.4,2.6 42,12.7 45.8,20.6 46.6,29.5 38.1,37.8 38.1,42 41.6,54.7 45.3,49.1 18.3,36.8 17.5,32.6 12.3,31.8 23.3,19.5 39.1,12.6 14.8,7.2 0.9,33.4 34.4,27.6 30,33.1 12.2,48.1 11.2,48.1 11.2,47.1 16,42.5 18,42.5 44,22.5 13.6,21.5 17.2,23.8 7.6,11.8 42.3,19.5 17,20
  pour Top (rank 5): -1,61 -1,-1 61,-1 61,61
  pour Bottom: -2,61 -2,-1 60,-1 60,61
  pour Top (no thermals): 6.1,17.9 8.2,17.9 8.2,18.5 6.1,18.5
  pour Top (no thermals): 6,11.5 8.1,11.5 8.1,12.1 6,12.1
GPIO1  (via drill 0.3)
  Top 0.2: U1.87 29.5,20.1 v29.9,19.7
  Bottom 0.2: v29.9,19.7 29.9,18.97 41.39,7.48 41.39,4.83 42.49,3.73 JP4.6
GPIO2  (via drill 0.3)
  Top 0.2: U1.90 31,21.15 31.1,21.05 v31.1,19.5
  Bottom 0.2: JP4.4 45.03,3.73 43.73,5.03 43.73,6.48 31.1,19.11 v31.1,19.5
GPIO3  (via drill 0.3)
  Top 0.2: U1.91 31.5,23.8 v31.3,24
  Bottom 0.2: v31.3,24 31.98,23.32 31.98,18.7 44.41,6.27 JP4.3
GPIO5  (via drill 0.3)
  Top 0.3: U1.24 38.6,35.5 39,35.9 v39,36.4 | JP11.1 41.9,49.12 v41.9,38.8
  Bottom 0.3: v41.9,38.8 39.5,36.4 v39,36.4
GPIO6  (via drill 0.3)
  Top 0.3: U1.23 39.17,35 v39.4,35.23 | v43.1,38.8 43.1,49.1 46,52 48,52 49.05,53.05 JP11.3
  Bottom 0.3: v39.4,35.23 42.97,38.8 v43.1,38.8
GPIO7  (via drill 0.3)
  Top 0.3: JP11.2 45.48,57.3 30.84,57.3 30.74,57.2 v30.2,57.2 | v27.4,44.5 25.5,42.6 U1.47
  Bottom 0.3: v30.2,57.2 30.2,55.8 29.4,55 28.1,55 27.4,54.3 v27.4,44.5
GPIO8
  Top 0.3: U1.48 25,42.65 24.7,42.95 24.7,56.9 25.66,57.85 47.47,57.85 JP11.4
GPIO_DRV  (via drill 0.3)
  Top 0.3: U1.43 v27.5,35.3 | v37.2,43 36.9,43.3 36.9,51.74 JP8.15
  Bottom 0.3: v27.5,35.3 28,34.8 32.4,34.8 33.7,36.1 33.7,39.8 36.9,43 v37.2,43
I2C_SCL  (via drill 0.3)
  Top 0.2: v33.5,24 U1.95 33.5,10.36 34.78,9.08 JP4.11
I2C_SDA
  Top 0.2: U1.96 34,10.5 37.32,7.18 JP4.9
LED1  (via drill 0.3)
  Top 0.2: U1.88 v30,24 | 44.25,17.05 43.85,17.05 v43.7,16.9
  Top 0.3: R6.2 49.05,13.65 47.2,15.5 45.8,15.5 44.25,17.05
  Bottom 0.2: v30,24 30,24.1 30.6,24.7 33.8,24.7 36.2,22.3 41.1,22.3 43.7,19.7 v43.7,16.9
LED2
  Top 0.3: R7.2 57.05,14.15 55.6,15.6 53.6,15.6 53.1,16.1 53.1,18 52.6,18.5 36.61,18.5 35,20.11 U1.98
LED3
  Top 0.3: U1.97 34.5,20.01 36.51,18 52.2,18 52.67,17.53 52.67,15.92 53.05,15.55 R9.2
N$1
  Top 0.3: R2.1 14.4,24.75 U4.6
N$2
  Top 0.2: LED4.A 54.75,14.45
  Top 0.3: R9.1 54.75,14.45
N$4
  Top 0.2: U1.49 24.5,39.55 C14.1
N$5
  Top 0.254: J1.B5 7.54,13.25 7.69,13.1 R16.1
N$6
  Top 0.254: J1.A5 9.4,16.25 R15.2
N$7
  Top 0.2: 20.85,25 C4.1
  Top 0.3: U1.73 20.85,25
N$8
  Top 0.3: R3.1 15.89,26.7 U4.4
N$11
  Top 0.2: LED1.A 46.65,14.4
  Top 0.3: R4.1 46.65,14.4
N$12
  Top 0.2: LED2.A 50.75,14.3
  Top 0.3: R6.1 50.75,14.3
N$13
  Top 0.2: LED3.A 58.75,14.3
  Top 0.3: R7.1 58.75,14.3
NRST  (via drill 0.3)
  Top 0.2: 39.7,39.95 SW1.4 40.35,40.1
  Top 0.3: U1.14 36.8,30.5 36.5,30.2 35.7,30.2 35.32,30.58 35.32,32.9 v35.02,33.2 | v39.7,38.9 39.7,39.95 | C5.1 R5.2 46.15,37.3 SW1.3 46,39.95 v46,39.1 | JP8.3 23.65,43.05 v23.6,43 | v31,35.63 31.63,35 v34.2,35
  Bottom 0.3: 35.02,35 35.02,37.82 36.2,39 39.6,39 v39.7,38.9 41.2,40.4 44.1,40.4 45.4,39.1 v46,39.1 | 35.02,35 v35.02,33.2 31.1,33.2 24.9,27 22,27 16.1,21.1 16.1,17.08 13.92,14.9 JP12.1 | v31,35.63 30.97,35.63 v23.6,43 | v34.2,35 35.02,35
OSC+
  Top 0.2: C1.2 43.5,29.5 41.9,29.5 41.3,28.9
  Top 0.3: 41.3,28.9 40.8,29.4 40.7,29.5 U1.12
  Top 0.4: X1.P$2 41.3,28.9
OSC-
  Top 0.2: C2.2 43.5,30.1 41.9,30.1 41.3,30.7
  Top 0.3: U1.13 40.6,30 41.3,30.7
  Top 0.4: X1.P$1 41.3,30.7
PWM1  (via drill 0.3)
  Top 0.3: JP7.4 13.5,55.47 14.6,54.37 14.6,51.3 17.8,48.1 v17.8,47.8 | v29,36.4 U1.40
  Bottom 0.3: v17.8,47.8 17.8,47.7 29,36.5 v29,36.4
PWM2  (via drill 0.3)
  Top 0.2: v16.6,48 16.5,48.1
  Top 0.3: U1.42 28,36.08 v28.29,35.79 | 16.5,48.1 16.5,48.73 13.5,51.73 JP7.3
  Bottom 0.2: 16.6,47.88 v16.6,48
  Bottom 0.3: v28.29,35.79 28.29,36.19 16.6,47.88
PWM3  (via drill 0.3)
  Top 0.3: JP7.2 12.3,54.93 12.3,51.9 v15.8,48.4 | U1.44 27,36.2 v26.7,35.9
  Bottom 0.3: v15.8,48.4 15.8,47.8 22.8,40.8 26.7,36.9 v26.7,35.9
PWM4  (via drill 0.3)
  Top 0.3: U1.45 26.5,36.7 v25.79,35.99 | v14.92,47.7 14.92,48.42 11.77,51.56 11.77,52.92 JP7.1
  Bottom 0.3: v25.79,35.99 25.79,36.99 15.08,47.7 v14.92,47.7
SPI1_MISO
  Top 0.3: U1.31 33.5,44.6 27.22,50.88 27.22,55.24 JP8.6
SPI1_MOSI
  Top 0.3: U1.32 33,44.4 26.19,51.21 JP8.5
SPI1_SCK
  Top 0.3: U1.30 34,44.8 27.7,51.1 27.7,55.24 JP8.8
SPI1_SS1
  Top 0.3: U1.29 34.5,44.9 28.3,51.1 28.3,53.3 JP8.7
SPI1_SS2  (via drill 0.3)
  Top 0.3: v32.1,44.2 31.5,43.6 U1.35
  Bottom 0.3: JP8.9 31.27,45.03 v32.1,44.2
SPI1_SS3  (via drill 0.3)
  Top 0.3: v30,44.3 v30.01,44.3 31,43.31 U1.36
  Bottom 0.3: JP8.10 31.27,55.19 30.24,54.16 30.24,44.54 v30,44.3
SPI2_MISO  (via drill 0.35)
  Top 0.2: v12.55,35.35 12.9,35 U1.53
  Bottom 0.2: v12.55,35.35 12.43,35.23 4.32,35.23 JP6.2
SPI2_MOSI  (via drill 0.35)
  Top 0.2: U1.54 12.3,34.5 11.6,35.2 11.6,35.9 v11.8,36.1
  Bottom 0.2: JP6.1 11.68,36.22 v11.8,36.1
SPI2_SCK  (via drill 0.35)
  Top 0.2: v13.18,35.98 13.65,35.5 U1.52
  Bottom 0.2: JP6.4 4.73,37.36 11.79,37.36 v13.18,35.98
SPI2_SS  (via drill 0.35)
  Top 0.2: v13.8,36.6 14.4,36 U1.51
  Bottom 0.2: JP6.6 4.77,39.86 6.66,39.86 7.98,38.54 11.86,38.54 v13.8,36.6
SPI2_SS2
  Top 0.2: U1.55 12.09,34 7.05,39.05 7.05,40.12 JP6.5
SPI2_SS3
  Top 0.2: U1.56 11.89,33.5 6.63,38.76 JP6.3
SPI3_CS1
  Top 0.3: JP4.17 25.5,7.92 25.5,19.25 24.5,20.25 U1.77
SPI3_CS2  (via drill 0.3)
  Top 0.3: U1.83 27.5,12.2 v28.4,11.3
  Bottom 0.3: v28.4,11.3 29,10.7 29,7.31 29.69,6.62 JP4.15
SPI3_CS3
  Top 0.3: U1.84 28,13 32.23,8.77 JP4.13
SPI3_MISO
  Top 0.2: JP4.16 29.69,3.93 28.63,4.99 28.63,8.38 26.5,10.5
  Top 0.3: U1.79 25.5,20.75 26.5,19.75 26.5,10.5
SPI3_MOSI
  Top 0.3: U1.80 26,21.05 27,20.05 27,10.63 31.02,6.62 31.02,3.73 JP4.14
SPI3_SCK
  Top 0.2: 26,10.3 28.2,8.1 28.2,4.96 27.15,3.91 JP4.18
  Top 0.3: U1.78 25,20.45 26,19.45 26,10.3
SWCLK  (via drill 0.3)
  Top 0.3: U1.76 24,19.45 v24.5,18.95
  Bottom 0.3: v24.5,18.95 23.7,18.15 22.84,18.15 21.54,16.84 JP12.4
SWDIO  (via drill 0.3)
  Top 0.3: U1.72 v23.8,25.5
  Bottom 0.3: v23.8,25.5 22.4,25.5 17.9,21 17.9,16.1 16.46,14.66 JP12.2
SWO  (via drill 0.3)
  Top 0.2: U1.89 v30.5,20.4
  Bottom 0.2: v30.5,20.4 30.5,19.01 42.39,7.12 JP4.5
UART1_RX
  Top 0.2: JP4.10 36.16,4.88 34.61,4.88 33.7,5.79 33.7,8.45 32.5,9.65 U1.93
UART1_TX
  Top 0.2: JP4.12 34.77,3.98 33.37,5.38 33.37,8.28 32,9.65 U1.92
USB_D+
  Top 0.3: U4.1 18.56,24.85 19.25,24.85 19.5,25.1 19.5,25.4 20.1,26 U1.71
USB_D+_IN  (via drill 0.3, 0.35)
  Top 0.254: J1.B6 5.65,14.25 5.5,14.4 5.5,15.1 5.65,15.25 J1.A6
  Top 0.3: R2.2 12.5,24.6 v12.5,23.8 | v9.3,14.32 9.23,14.25 J1.B6
  Bottom 0.3: v12.5,23.8 12,23.8 9.3,21.1 v9.3,14.32
USB_D-
  Top 0.3: U1.70 18.61,26.5 U4.3
USB_D-_IN  (via drill 0.3, 0.35)
  Top 0.254: J1.B7 7.24,15.75 7.48,15.51 7.48,15.3 7.48,14.99 7.24,14.75 J1.A7
  Top 0.3: v11.8,26.5 11.99,26.7 R3.2 | v7.95,15.3 7.48,15.3
  Bottom 0.3: v11.8,26.5 10.73,25.44 10.73,23.84 8.37,21.47 8.37,15.72 v7.95,15.3
USB_SHIELD
  Top 0.3: C16.1 8.53,10.68 J1.S4
  pour Top (no thermals): 7,19 4.2,19 4.2,11 7.2,11 7.2,10.3 1.2,10.3 1.2,19.7 7,19.7
USB_VBUS
  Top 0.3: U1.68 19.15,27.5 R14.1
USB_VBUS_IN  (via drill 0.3)
  Top 0.254: J1.B4_A9 6.25,12.8 5.61,12.8 4.9,13.51 4.9,16.49 5.61,17.2 6.25,17.2 J1.A4_B9
  Top 0.3: R14.2 17,28.15 17,26.3 16.4,25.7 v15.2,25.7 | v10.5,20.1 10.5,19.38 D1.A
  Top 0.4: D1.A 10,18.52 | U4.5 v15.2,25.7
  Top 0.5: D1.A 9.9,18.88 8.42,17.4 J1.A4_B9
  Bottom 0.3: v15.2,25.7 15.2,24.69 10.61,20.1 v10.5,20.1
V_EXT  (via drill 0.3)
  Top 0.3: v33,36.3 33,36.45 32.5,36.95 U1.33
  Bottom 0.3: JP8.13 35.73,53.11 35.73,42.74 32.5,39.51 32.5,37 33,36.5 v33,36.3
V_INT  (via drill 0.3)
  Top 0.3: U1.34 v32,36.3
  Bottom 0.3: v32,36.3 32,39.9 35.2,43.1 35.2,55.12 JP8.14
VDDA
  Top 0.2: U1.21 U1.22 | C13.2 40.4,34.45 | 37.8,34.45 37.75,34.4
  Top 0.3: 40.4,34.45 37.8,34.45 | U1.21 37.75,34.4 | C13.2 40.81,34.64 L1.2

### Text on the board
tPlace: 3 | 1 | GP7 | GP8 | 4 | 2 | GP5 | GP6 | Open FFBoard / USB interface | PWM | V1.2.4 | GND | SW | RESET | GND | SPI 2 | 3v3 | 3v3 | 3v3 | 3v3 | CS | CS2 | GND | GND | 1 | 2 | SCK | CS3 | Analog | MOSI | 3 | 4 | MISO | 5 | 6 | Encoder | 5V | Z | 1 | 2 | B | 3 | 4 | Digital | A | 5 | 6 | 7 | 8 | GND | BOOT0 | GND | GND | PWR | SYS | FFB | ERR | SWD | GND | EXT | RST | SWC | 3v3 | CANR | CANH | 5V | CS1 | CS2 | CS3 | SCL | SDA | 3V3 | GP4 | GP3 | E-STOP | 120 | CANL | CANR | GND | SCK | MI3 | MO3 | TX | RX | GND | GP1 | GP2 | GND
bPlace: TX | RX | Motor | 3 | 1 | GP7 | GP8 | 2 | 16 | 1 | RST | 3V3 | MOSI | MISO | CS1 | SCK | CS2 | CS3 | FLAG | BRAKE | V_EXT | V_INT | DRV_GP | EN | GP5 | GP6 | 4 | 2 | GND | 5V | PWM | TIM/ADC | V1.2.4 | Open FFBoard / USB interface | GND | GND | 3v3 | 3v3 | 3v3 | 3v3 | CS | CS2 | Analog | GND | GND | SPI 2 | SCK | CS3 | 1 | 2 | MISO | MOSI | 3 | 4 | 5 | 6 | 5V | Z | 1 | 2 | B | F407V | 3 | 4 | A | Digital | 5 | 6 | Encoder | 7 | 8 | GND | GND | GND | RST | GND | SWD | SWC | 3v3 | YR 2022 | EXT | E-STOP | CANH | 5V | CS1 | CS2 | CS3 | SCL | SDA | 3V3 | SWO | GP4 | GP3 | 120R / CAN | CANL | GND | SCK | MI3 | MO3 | TX | RX | GND | GP1 | GP2 | GND